# Altium schematic sheet Connectors.SchDoc
size A4; SheetNumber: 9; SheetTotal: 10
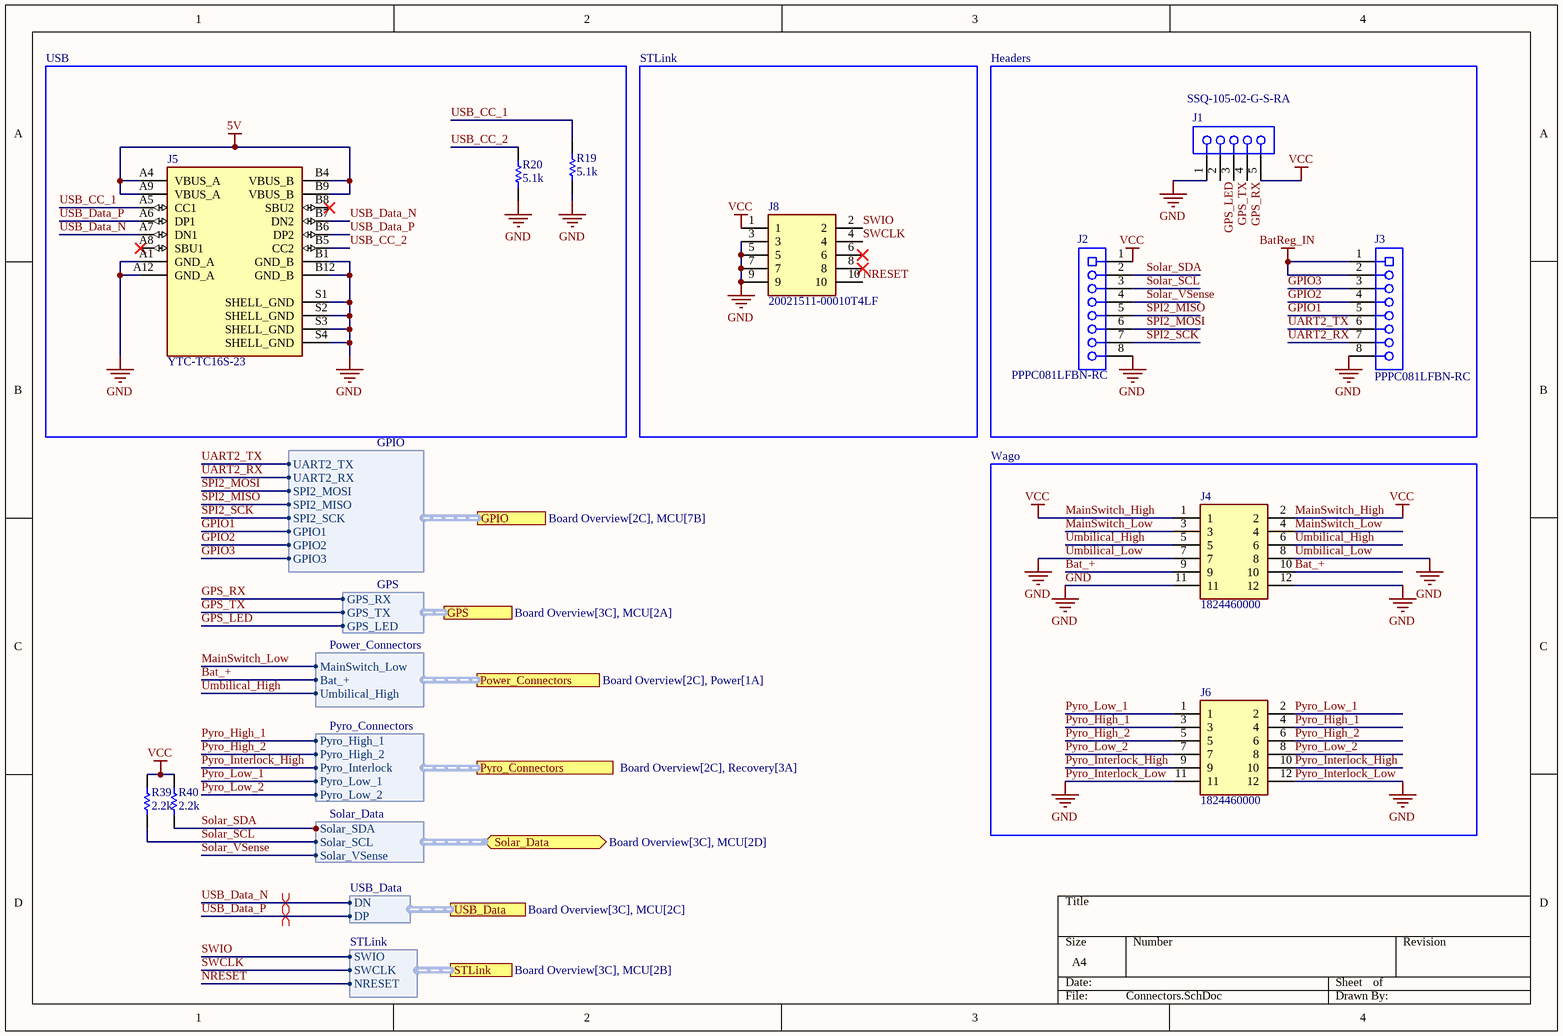
[diagram p0: Connectors.SchDoc]

## Parts
J1  SSQ-105-02-G-S-RA  [SMTC-SSQ-105-02-X-S-RA]
J2  PPPC081LFBN-RC  [SLIN-PPPC081LFBN-RC_V]
J3  PPPC081LFBN-RC  [SLIN-PPPC081LFBN-RC_V]
J4  1824460000  [SHDR12W80P700X350_2X6_2170X1400X850P]
J5  YTC-TC16S-23  [VALCON_CSP-USC16-TR]
J6  1824460000  [SHDR12W80P700X350_2X6_2170X1400X850P]
J8  20021511-00010T4LF  [2002151100010T4LF]
R19  value 5.1k  [RESC1609X50X30ML8T20]  (hidden comment: Generic-Resistor)
R20  value 5.1k  [RESC1609X50X30ML8T20]  (hidden comment: Generic-Resistor)
R39  value 2.2k  [RESC1609X50X30ML8T20]  (hidden comment: Generic-Resistor)
R40  value 2.2k  [RESC1609X50X30ML8T20]  (hidden comment: Generic-Resistor)

## Blocks framed on the sheet
USB: J5 R19 R20
STLink: J8
Headers: J1-J3
Wago: J4 J6

## Ports
GPIO (harness GPIO, see Board Overview[2C], MCU[7B]), GPS (harness GPS, see Board Overview[3C], MCU[2A]), Power_Connectors (harness Power_Connectors, see Board Overview[2C], Power[1A]), Pyro_Connectors (harness Pyro_Connectors, see Board Overview[2C], Recovery[3A]), Solar_Data (bidir, harness Solar_Data, see Board Overview[3C], MCU[2D]), STLink (harness STLink, see Board Overview[3C], MCU[2B]), USB_Data (harness USB_Data, see Board Overview[3C], MCU[2C])

## Harnesses
USB_Data: DP, DN
GPS: GPS_RX, GPS_TX, GPS_LED
Power_Connectors: Bat_+, MainSwitch_Low, Umbilical_High
Pyro_Connectors: Pyro_High_1, Pyro_High_2, Pyro_Interlock, Pyro_Low_1, Pyro_Low_2
Solar_Data: Solar_SCL, Solar_SDA, Solar_VSense
STLink: SWIO, SWCLK, NRESET
GPIO: UART2_TX, UART2_RX, SPI2_MOSI, SPI2_MISO, SPI2_SCK, GPIO1, GPIO2, GPIO3

## Nets
5V: J5.A4(VBUS_A) J5.A9(VBUS_A) J5.B4(VBUS_B) J5.B9(VBUS_B)
BatReg_IN: J3.1 J3.2
GND: J1.1 J2.8 J3.8 J4.7 J4.8 J4.11 J4.12 J5.A1(GND_A) J5.A12(GND_A) J5.B1(GND_B) J5.B12(GND_B) J5.S1(SHELL_GND) J5.S2(SHELL_GND) J5.S3(SHELL_GND) J5.S4(SHELL_GND) J6.11 J6.12 J8.3 J8.5 J8.7 J8.9 R19.2 R20.2  [also labelled Pyro_Interlock_Low, Umbilical_Low]
MainSwitch_High: J1.5 J2.1 J4.1 J4.2 J8.1 R39.1 R40.1  [also labelled VCC]
Bat_+: J4.9 J4.10 ; port Power_Connectors.Bat_+
GPIO1: J3.5 ; port GPIO.GPIO1
GPIO2: J3.4 ; port GPIO.GPIO2
GPIO3: J3.3 ; port GPIO.GPIO3
GPS_LED: J1.2 ; port GPS.GPS_LED
GPS_RX: J1.4 ; port GPS.GPS_RX
GPS_TX: J1.3 ; port GPS.GPS_TX
MainSwitch_Low: J4.3 J4.4 ; port Power_Connectors.MainSwitch_Low
NRESET: J8.10 ; port STLink.NRESET
Pyro_High_1: J6.3 J6.4 ; port Pyro_Connectors.Pyro_High_1
Pyro_High_2: J6.5 J6.6 ; port Pyro_Connectors.Pyro_High_2
Pyro_Interlock_High: J6.9 J6.10 ; port Pyro_Connectors.Pyro_Interlock
Pyro_Low_1: J6.1 J6.2 ; port Pyro_Connectors.Pyro_Low_1
Pyro_Low_2: J6.7 J6.8 ; port Pyro_Connectors.Pyro_Low_2
Solar_SCL: J2.3 R39.2 ; port Solar_Data.Solar_SCL
Solar_SDA: J2.2 R40.2 ; port Solar_Data.Solar_SDA
Solar_VSense: J2.4 ; port Solar_Data.Solar_VSense
SPI2_MISO: J2.5 ; port GPIO.SPI2_MISO
SPI2_MOSI: J2.6 ; port GPIO.SPI2_MOSI
SPI2_SCK: J2.7 ; port GPIO.SPI2_SCK
SWCLK: J8.4 ; port STLink.SWCLK
SWIO: J8.2 ; port STLink.SWIO
UART2_RX: J3.7 ; port GPIO.UART2_RX
UART2_TX: J3.6 ; port GPIO.UART2_TX
Umbilical_High: J4.5 J4.6 ; port Power_Connectors.Umbilical_High
USB_CC_1: J5.A5(CC1) R19.1
USB_CC_2: J5.B5(CC2) R20.1
USB_Data_N: J5.A7(DN1) J5.B7(DN2) ; port USB_Data.DN
USB_Data_P: J5.A6(DP1) J5.B6(DP2) ; port USB_Data.DP

Not connected (* = marked no-connect by the designer): J5 A8(SBU1)* B8(SBU2)*; J8 6* 8*

## Layout directives
differential pair: USB_Data_N, USB_Data_P

## Library data of the parts
J1 = CMP-002-00078-1: Headers & Wire Housings Tiger Buy Socket Strip with Square Tails, 0.100 Pitch
J2 J3 = CMP-002-00028-2: Female Header, Pitch 2.54 mm, 1 x 8 Position, Height 8.5 mm, Tail Length 3.2 mm, -40 to 105 degC, RoHS, Bulk; Manufacturer: Sullins; Package Reference: PPPC081LFBN-RC; Connector Type: Header; Datasheet Version: Jan-15; Package Description: Female Header, Pitch 2.54 mm, 1 x 8 Position, Height 8.5 mm, Tail Length 3.2 mm; RoHS Compliant: Unknown; Max Operating Temperature: 105°C; Case/Package: PPPC081LFBN-RC; Min Operating Temperature: -40°C; Datasheet URL: http://sullinscorp.com/catalogs/101_PAGE114-115_.100_FEMALE_HDR.pdf; Gender: Female; Mounting Technology: TH
J4 J6 = CMP-062-000000-2: Printed circuit board terminals, 3.50 mm, Number of poles: 6, 90, Solder pin length: 3.5 mm, black, PUSH IN with actuator, Clamping range, max. [rated connection]: 1.5 mm, Tube; Manufacturer_Name: Weidmuller; Geometry.Height: 8.5mm; Mouser Price/Stock: https://www.mouser.co.uk/ProductDetail/Weidmuller/1824460000?qs=WJDKaGZ8K%252B6qGfZkM4Ritg%3D%3D; Design Item ID: 1824460000; Mouser Part Number: 470-1824460000; Datasheet Link: http://catalog.weidmueller.com/createDatasheetForMobile.do?ordernumber=1824460000&scope1=1&scope2=1&localeId=en; Source: 1824460000.SchLib; Manufacturer_Part_Number: 1824460000
J5 = CMP-042-000000-3: YTC-TC16S-23 USB Type C Surface Mount PCB Socket 3A; MP: CSP-USC16-TR; Pin Count: 20; Availability: In Stock; Design Item ID: CSP-USC16-TR; LCSC Part #: C2927300
J8 = CMP-003-000001-3: 1.27mm (0.05in.) pitch, Shrouded header, 10 contacts; Manufacturer_Name: Amphenol Communications Solutions; Geometry.Height: 5.65mm; Mouser Part Number: 649-221511-00010T4LF; Datasheet Link: https://cdn.amphenol-cs.com/media/wysiwyg/files/drawing/20021511.pdf; Mouser Price/Stock: https://www.mouser.co.uk/ProductDetail/Amphenol-FCI/20021511-00010T4LF?qs=oJs1R%252BxK6kSq16VF%2F5iyPQ%3D%3D; Design Item ID: 20021511-00010T4LF; Source: 20021511-00010T4LF.SchLib; Manufacturer_Part_Number: 20021511-00010T4LF
R19 R20 R39 R40 = CMP-009-00185-4: Generic 0603 Resistor; Power Rating: 100mW; Tolerance: 0%; Voltage Rating: 75V; Case Code (Metric): 1608; Case Code (Imperial): 0603
  R19 R20: LCSC Part #: C23186
  R39 R40: LCSC Part #: C4190